# EAGLE design UserInterface_RevB (EAGLE 7.6.0)

## Sheet 1 of 2
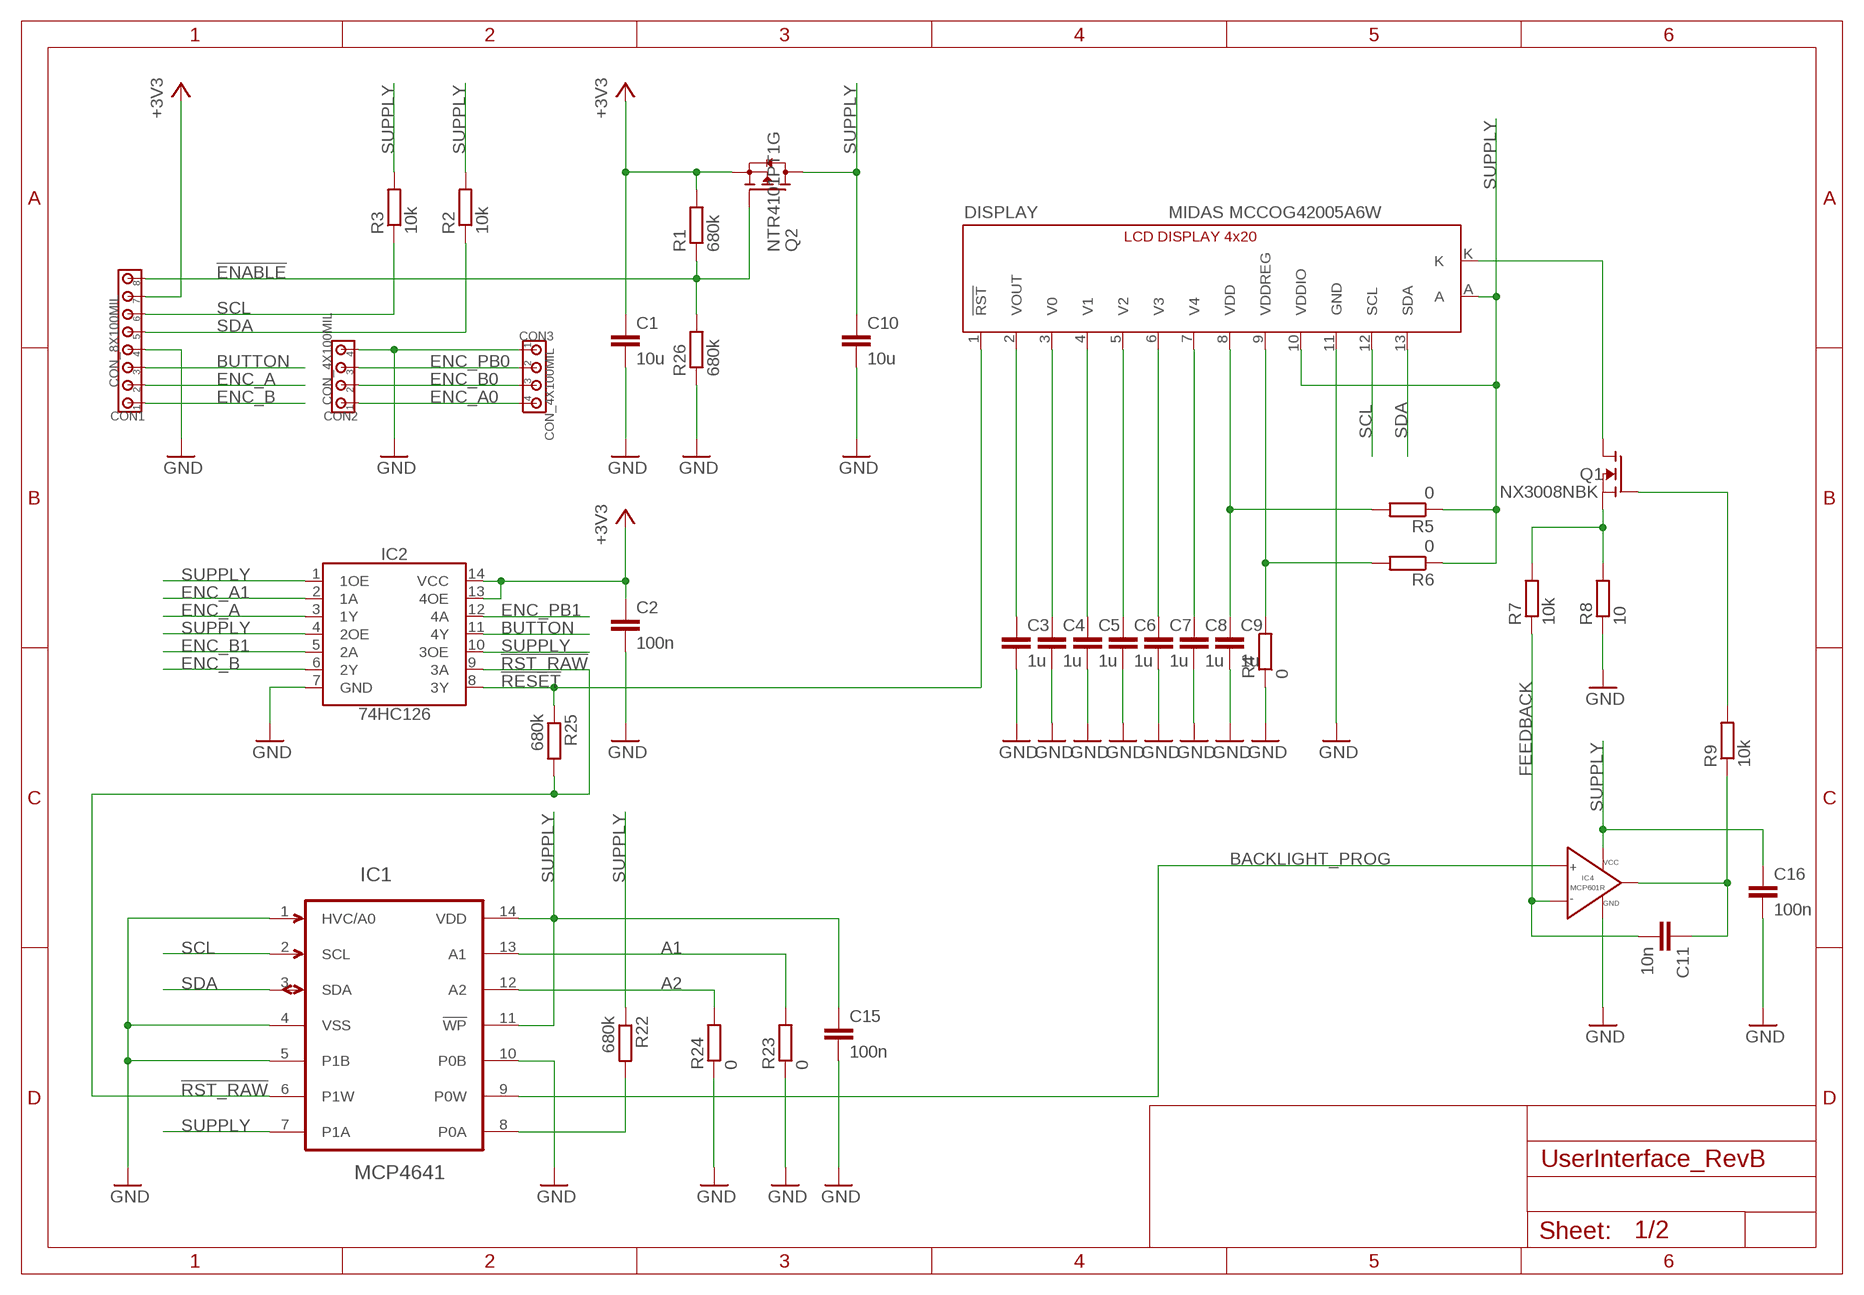
[diagram p0: schematic, sheet 1]

### Parts
C1  10u  CC0805  [C0805]
C2  100n  CC0805  [C0805]
C3  1u  CC0805  [C0805]
C4  1u  CC0805  [C0805]
C5  1u  CC0805  [C0805]
C6  1u  CC0805  [C0805]
C7  1u  CC0805  [C0805]
C8  1u  CC0805  [C0805]
C9  1u  CC0805  [C0805]
C10  10u  CC0805  [C0805]
C11  10n  CC0805  [C0805]
C15  100n  CC0805  [C0805]
C16  100n  CC0805  [C0805]
CON1  CON_8X100MIL  [100MIL_8X]
CON2  CON_4X100MIL  [100MIL_4X]
CON3  CON_4X100MIL  [100MIL_4X]
DISPLAY  MIDAS MCCOG42005A6W  LCD4X20_I2C  [LCD_4X20_I2C]
IC1  MCP4641  [TSSOP14]
IC2  74HC126  [SO14]
IC4  MCP601R  [SOT-23-5]
Q1  NX3008NBK  N-FETSOT23  [SOT23]
Q2  NTR4101PT1G  P-FETSOT23  [SOT23]
R1  680k  RESISTORR0805  [R0805]
R2  10k  RESISTORR0805  [R0805]
R3  10k  RESISTORR0805  [R0805]
R4  0  RESISTORR0805  [R0805]
R5  0  RESISTORR0805  [R0805]
R6  0  RESISTORR0805  [R0805]
R7  10k  RESISTORR0805  [R0805]
R8  10  RESISTORR0805  [R0805]
R9  10k  RESISTORR0805  [R0805]
R22  680k  RESISTORR0805  [R0805]
R23  0  RESISTORR0805  [R0805]
R24  0  RESISTORR0805  [R0805]
R25  680k  RESISTORR0805  [R0805]
R26  680k  RESISTORR0805  [R0805]

### Nets
!ENABLE!: CON1.8 Q2.1(G) R1.1 R26.2
!RESET!: DISPLAY.1(!RST!) IC2.8(3Y) R25.1
!RST_RAW!: IC1.6(P1W) IC2.9(3A) R25.2
+3V3: C1.1 C2.1 CON1.7 IC2.13(4OE) IC2.14(VCC) Q2.2(S) R1.2 ; also sheet 2
A1: IC1.13(A1) R23.2
A2: IC1.12(A2) R24.2
BACKLIGHT_PROG: IC1.9(P0W) IC4.3(VIN+)
BUTTON: CON1.3 IC2.11(4Y) ; also sheet 2
ENC_A: CON1.2 IC2.3(1Y) ; also sheet 2
ENC_A0: CON2.1 CON3.4 ; also sheet 2
ENC_A1: IC2.2(1A) ; also sheet 2
ENC_B: CON1.1 IC2.6(2Y) ; also sheet 2
ENC_B0: CON2.2 CON3.3 ; also sheet 2
ENC_B1: IC2.5(2A) ; also sheet 2
ENC_PB0: CON2.3 CON3.2 ; also sheet 2
ENC_PB1: IC2.12(4A) ; also sheet 2
FEEDBACK: C11.2 IC4.4(VIN-) R7.1
GND: C1.2 C2.2 C3.2 C4.2 C5.2 C6.2 C7.2 C8.2 C9.2 C10.2 C15.2 C16.2 CON1.4 CON2.4 CON3.1 DISPLAY.11(GND) IC1.1(HVC/A0) IC1.4(VSS) IC1.5(P1B) IC1.10(P0B) IC2.7(GND) IC4.5(GND) R4.1 R8.1 R23.1 R24.1 R26.1 ; also sheet 2
LED_K: DISPLAY.K Q1.3(D)
N$3: C3.1 DISPLAY.2(VOUT)
N$4: C4.1 DISPLAY.3(V0)
N$5: C8.1 DISPLAY.7(V4)
N$6: C7.1 DISPLAY.6(V3)
N$7: C6.1 DISPLAY.5(V2)
N$8: C5.1 DISPLAY.4(V1)
N$14: C11.1 IC4.1(VOUT) R9.1
N$15: Q1.1(G) R9.2
N$17: Q1.2(S) R7.2 R8.2
N$19: IC1.8(P0A) R22.2
SCL: CON1.6 DISPLAY.12(SCL) IC1.2(SCL) R3.1
SDA: CON1.5 DISPLAY.13(SDA) IC1.3(SDA) R2.1
SUPPLY: C10.1 C15.1 C16.1 DISPLAY.10(VDDIO) DISPLAY.A IC1.7(P1A) IC1.11(!WP!) IC1.14(VDD) IC2.1(1OE) IC2.4(2OE) IC2.10(3OE) IC4.2(VCC) Q2.3(D) R2.2 R3.2 R5.1 R6.1 R22.1 ; also sheet 2
VDD: C9.1 DISPLAY.8(VDD) R5.2
VDREG: DISPLAY.9(VDDREG) R4.2 R6.2

## Sheet 2 of 2
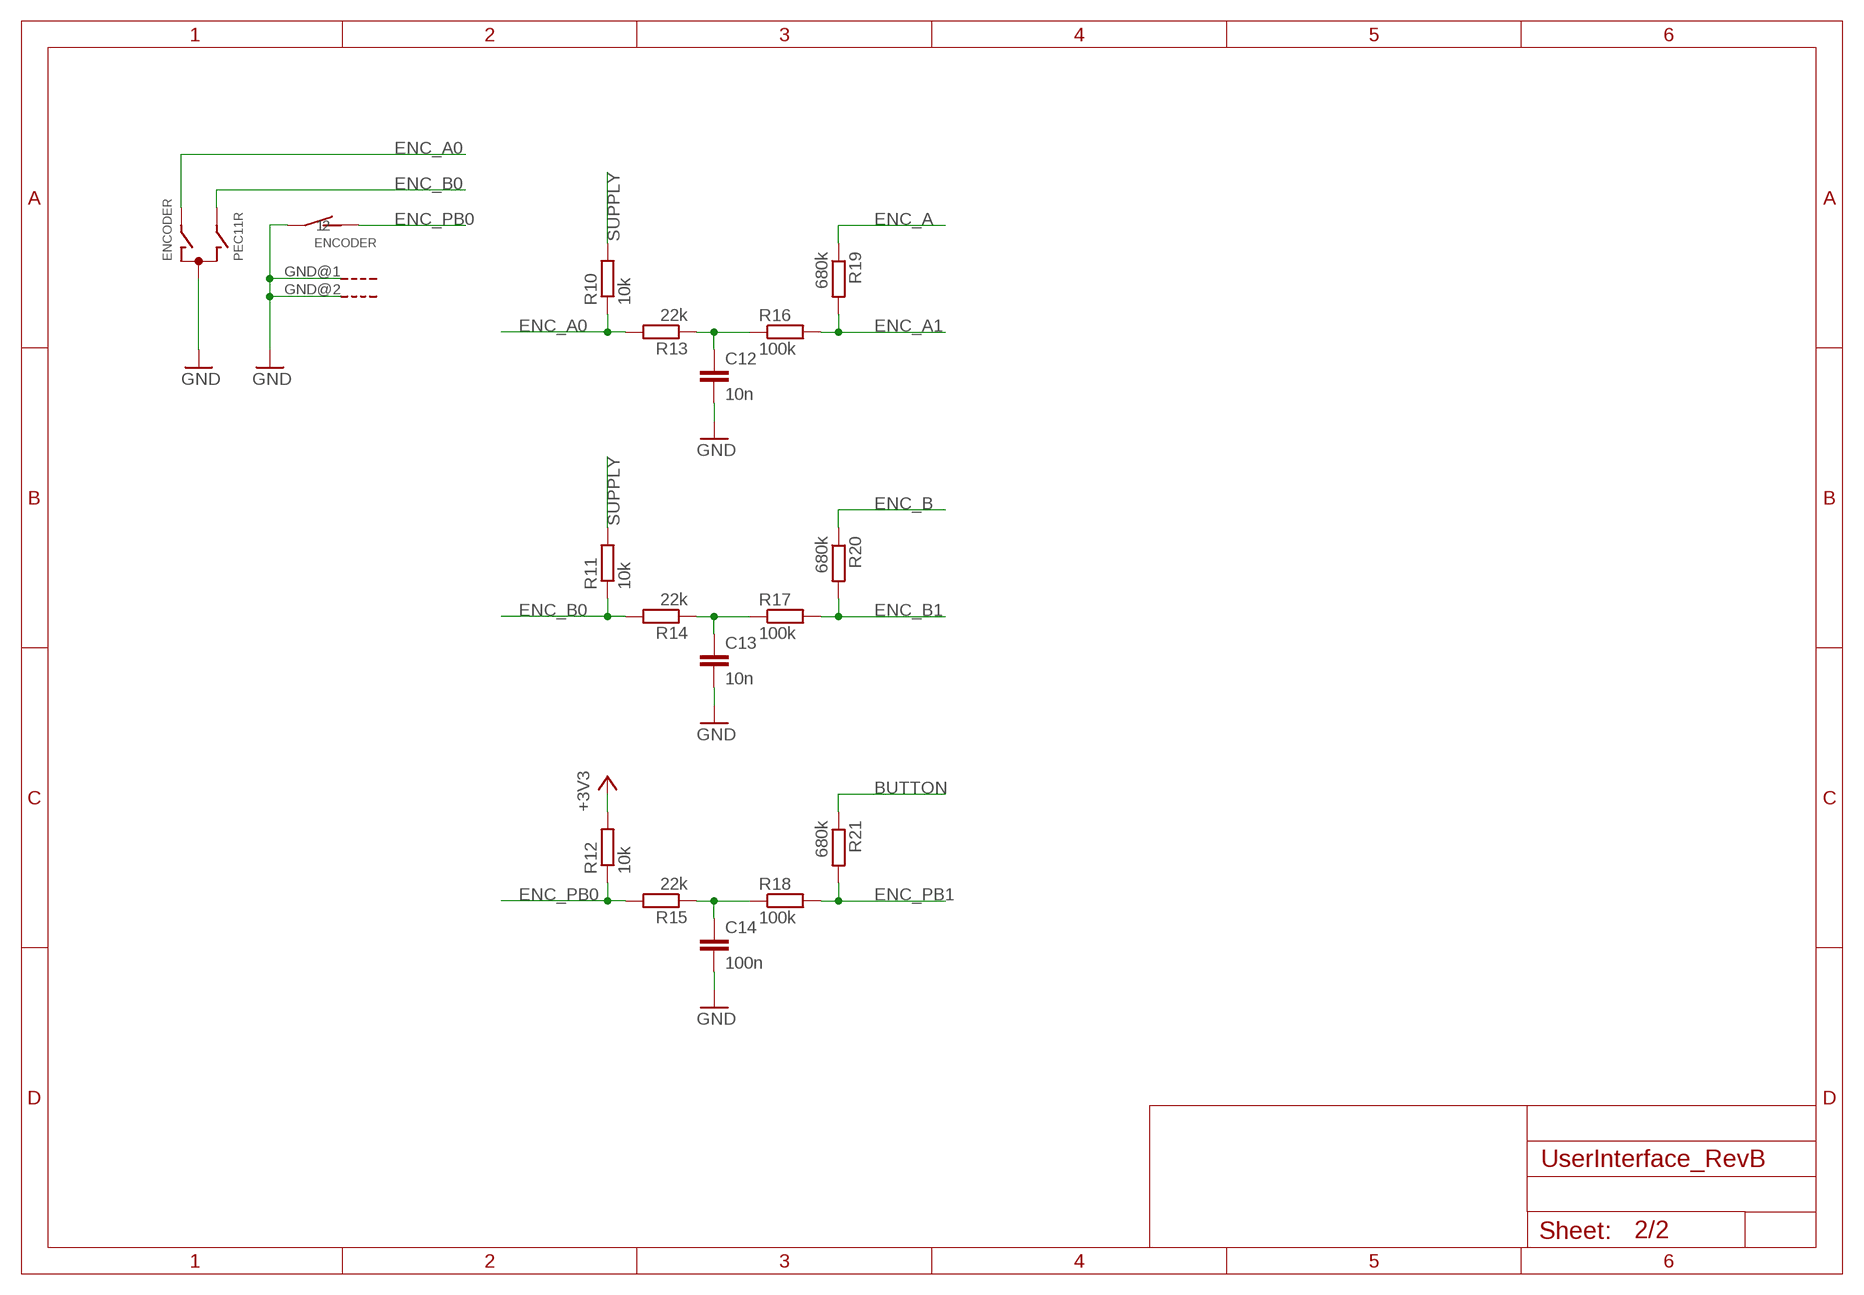
[diagram p1: schematic, sheet 2]

### Parts
C12  10n  CC0805  [C0805]
C13  10n  CC0805  [C0805]
C14  100n  CC0805  [C0805]
ENCODER  PEC11R  ENCODER_BOURNS  [ENCODER_BOURNS]
R10  10k  RESISTORR0805  [R0805]
R11  10k  RESISTORR0805  [R0805]
R12  10k  RESISTORR0805  [R0805]
R13  22k  RESISTORR0805  [R0805]
R14  22k  RESISTORR0805  [R0805]
R15  22k  RESISTORR0805  [R0805]
R16  100k  RESISTORR0805  [R0805]
R17  100k  RESISTORR0805  [R0805]
R18  100k  RESISTORR0805  [R0805]
R19  680k  RESISTORR0805  [R0805]
R20  680k  RESISTORR0805  [R0805]
R21  680k  RESISTORR0805  [R0805]

### Nets
+3V3: R12.2 ; also sheet 1
BUTTON: R21.1 ; also sheet 1
ENC_A: R19.1 ; also sheet 1
ENC_A0: ENCODER.A R10.1 R13.2 ; also sheet 1
ENC_A1: R16.2 R19.2 ; also sheet 1
ENC_B: R20.1 ; also sheet 1
ENC_B0: ENCODER.B R11.1 R14.2 ; also sheet 1
ENC_B1: R17.2 R20.2 ; also sheet 1
ENC_PB0: ENCODER.1 R12.1 R15.2 ; also sheet 1
ENC_PB1: R18.2 R21.2 ; also sheet 1
GND: C12.2 C13.2 C14.2 ENCODER.2 ENCODER.C ENCODER.GND@1(G) ENCODER.GND@2(G) ; also sheet 1
N$9: C13.1 R14.1 R17.1
N$12: C12.1 R13.1 R16.1
N$13: C14.1 R15.1 R18.1
SUPPLY: R10.2 R11.2 ; also sheet 1

## Library data of the parts
C1-C16 = 00Capacitor:C: Capacitor
CON1 = 00Connector:CON_8X: 8-pin header
CON2 CON3 = 00Connector:CON_4X: 4-pin header
DISPLAY = 00Display:LCD4X20_I2C: 4x20 character LCD display with I2C interface
ENCODER = 00Switch:ENCODER_BOURNS: Bourns Rotary Encoder with Switch PEC11-4xxxF-Sxxxx
IC1 = 00DigiPot:MCP4641: Dual DigiPot with 128 steps and non-volatile memory
IC2 = 00Logic:74HC126: Quad buffer/line driver; 3-state
IC4 = 00OpAmp:MCP601R
Q1 = 00Mosfet:N-FET: N-Channel MOSFET
Q2 = 00Mosfet:P-FET
R1-R26 = 00Resistor:RESISTOR: RESISTOR, European symbol

## Board
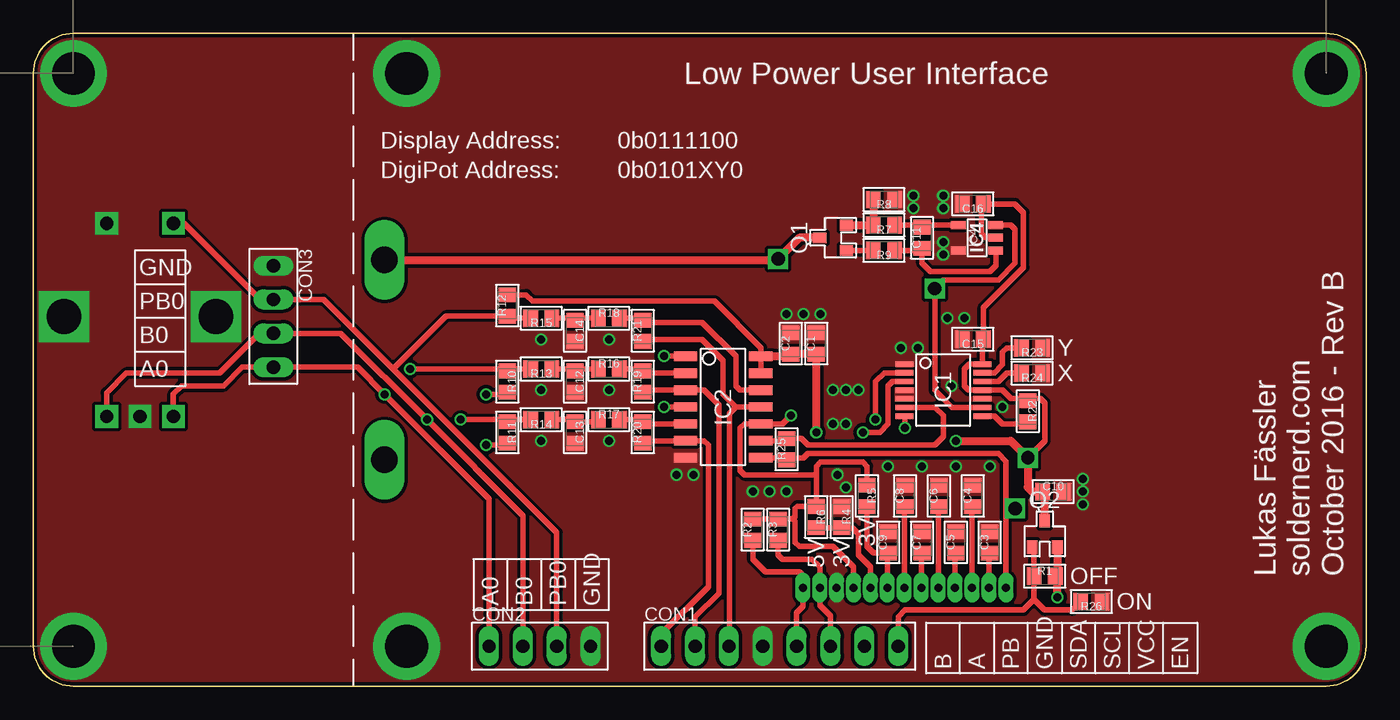
[diagram p2: board, top side]
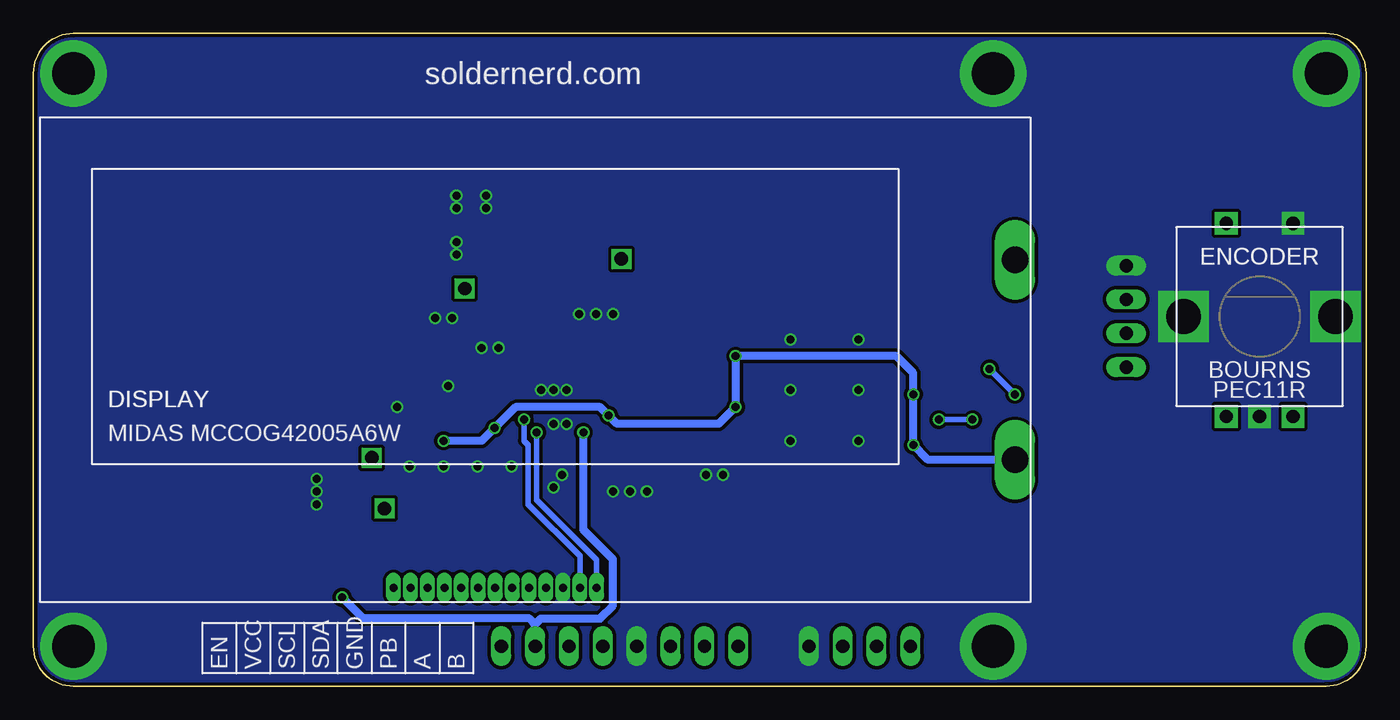
[diagram p3: board, bottom side, seen from below]

Size 100 x 49 mm. Coordinates in mm from the lower left corner, seen from the top.
Outline: 0,3 0,46 arc-90 3,49 97,49 arc-90 100,46 100,3 arc-90 97,0 3,0 arc-90 0,3
Copper layers (1*16): Top 0.035mm / dielectric 1.5mm / Bottom 0.035mm
Design rules "dirt_cheap_dirty_boards.v1": minimum track width 5mil, minimum drill 12mil, track to track 5mil, track to pad 5mil, pad to pad 5mil, via to via 5mil, smd to smd 0mil, copper to edge 10mil, drill to drill 10mil, minimum pad ring 10mil, minimum via ring 6mil, stop-mask expansion 2mil, vias tented up to drill 25mil, thermal gap 10mil

### Footprints (pad centres in the part's own frame; a part is rotated, then mirrored left to right if it is on the bottom)
C0805 = smd 1.1 x 1.3: 1 -0.8,0; 2 0.8,0
100MIL_8X = drill 1 long: 1 -8.89,0; 2 -6.35,0; 3 -3.81,0; 4 -1.27,0; 5 1.27,0; 6 3.81,0; 7 6.35,0; 8 8.89,0
100MIL_4X = drill 1 long: 1 -3.81,0; 2 -1.27,0; 3 1.27,0; 4 3.81,0
LCD_4X20_I2C = drill 0.6 pad 1 long: 1 26.53,1.1; 2 27.8,1.1; 3 29.07,1.1; 4 30.34,1.1; 5 31.61,1.1; 6 32.88,1.1; 7 34.15,1.1; 8 35.42,1.1; 9 36.69,1.1; 10 37.96,1.1; 11 39.23,1.1; 12 40.5,1.1; 13 41.77,1.1 | drill 2 long: A 73.15,10.7; K 73.15,25.7
ENCODER_BOURNS = drill 1 pad 1.7 square: 1 -2.5,7; 2 2.5,7; A -2.5,-7.5; B 2.5,-7.5; C 0,-7.5 | drill 2.6 pad 3.8 square: GND@1 -5.7,0; GND@2 5.7,0
TSSOP14 = smd 0.4 x 1.35: 1 -1.95,-2.925; 2 -1.3,-2.925; 3 -0.65,-2.925; 4 0,-2.925; 5 0.65,-2.925; 6 1.3,-2.925; 7 1.95,-2.925; 8 1.95,2.925; 9 1.3,2.925; 10 0.65,2.925; 11 0,2.925; 12 -0.65,2.925; 13 -1.3,2.925; 14 -1.95,2.925
SO14 = smd 0.7 x 1.75: 1 -3.81,-2.825; 2 -2.54,-2.825; 3 -1.27,-2.825; 4 0,-2.825; 5 1.27,-2.825; 6 2.54,-2.825; 7 3.81,-2.825; 8 3.81,2.825; 9 2.54,2.825; 10 1.27,2.825; 11 0,2.825; 12 -1.27,2.825; 13 -2.54,2.825; 14 -3.81,2.825
SOT-23-5 = smd 0.6 x 1.1: 1 -0.95,-1.4; 2 0,-1.4; 3 0.95,-1.4; 4 0.95,1.4; 5 -0.95,1.4
SOT23 = smd 0.8 x 1: 1 -0.95,-1; 2 0.95,-1; 3 0,1
R0805 = smd 1.1 x 1.3: 1 -0.8,0; 2 0.8,0

### Placement (x,y rotation side)
C1  58.74,25.72 90 top
C2  56.83,25.72 90 top
C3  71.75,10.79 90 top
C4  70.48,14.29 90 top
C5  69.22,10.79 90 top
C6  67.94,14.29 90 top
C7  66.67,10.79 90 top
C8  65.41,14.29 90 top
C9  64.14,10.79 90 top
C10  76.52,14.61 0 top
C11  66.67,33.66 90 top
C12  40.64,22.86 270 top
C13  40.64,19.05 270 top
C14  40.64,26.67 270 top
C15  70.48,26.04 180 top
C16  70.48,36.2 180 top
CON1  56,3 0 top
CON2  38,3 0 top
CON3  18,27.75 270 top
DISPLAY  99.5,6.3 0 bottom
ENCODER  8,27.75 0 bottom
IC1  68.26,22.23 270 top
IC2  51.75,20.95 270 top
IC4  70.8,33.66 90 top
Q1  60.01,33.66 90 top
Q2  75.88,11.43 0 top
R1  75.88,8.26 0 top
R2  53.98,11.75 90 top
R3  55.88,11.75 90 top
R4  60.64,12.7 270 top
R5  62.55,14.29 270 top
R6  58.74,12.7 270 top
R7  63.82,34.61 180 top
R8  63.82,36.51 180 top
R9  63.82,32.7 180 top
R10  35.56,22.86 270 top
R11  35.56,19.05 270 top
R12  35.56,28.57 90 top
R13  38.1,23.81 180 top
R14  38.1,20 180 top
R15  38.1,27.62 180 top
R16  43.18,23.81 0 top
R17  43.18,20 0 top
R18  43.18,27.62 0 top
R19  45.72,22.86 90 top
R20  45.72,19.05 90 top
R21  45.72,26.67 90 top
R22  74.61,20.64 270 top
R23  74.93,25.4 180 top
R24  74.93,23.5 180 top
R25  56.52,17.78 90 top
R26  79.38,6.35 180 top

### Tracks (layer width: path | path; a pad name or v marks a point on that pad's centre or on a via)
!ENABLE!
  Top 0.406: CON1.8 64.89,5.2 65.41,5.71 74.3,5.71 75.08,6.5 | 75.08,6.5 R1.1 75.08,10.28 Q2.1 | 75.08,6.5 75.87,5.71 77.94,5.71 R26.2
!RESET!  (via drill 1)
  Top 0.406: DISPLAY.1 72.97,13.34 | 72.97,13.34 72.97,16.88 72.39,17.46 58.1,17.46 57.78,17.14 56.52,17.14 R25.1 56.35,17.14 IC2.8 | v73.66,13.34 72.97,13.34
!RST_RAW!
  Top 0.406: IC2.9 56.35,18.41 R25.2 57.62,18.58 58.1,18.1 67.63,18.1 68.26,18.73 68.26,20.32 67.66,20.93 IC1.6
+3V3  (via drill 0.6)
  Top 0.406: R12.2 36.98,29.38 37.47,28.89 51.12,28.89 54.61,25.4 54.61,24.8 IC2.14 IC2.13 | 56.71,24.8 56.83,24.8 C2.1
  Top 0.61: v58.74,19.05 C1.1 C2.1 | 54.61,24.8 56.71,24.8 | Q2.2 76.83,8.4 R1.2 76.83,8.1 v76.83,6.67
  Bottom 0.61: CON1.7 62.35,4.64 | v58.74,19.05 58.74,11.75 56.52,9.53 56.52,6.03 57.47,5.08 61.91,5.08 62.35,4.64 | v76.83,6.67 75.25,5.08 62.79,5.08 62.35,4.64
A1
  Top 0.406: IC1.13 72.1,23.52 72.71,24.13 72.71,25.08 73.03,25.4 R23.2
A2
  Top 0.406: IC1.12 72.41,22.88 73.03,23.5 R24.2
BACKLIGHT_PROG  (via drill 1)
  Top 0.406: IC1.9 68.93,20.93 67.63,22.23 v67.63,29.84 68.26,30.48 72.39,30.48 73.66,31.75 73.66,34.29 73.34,34.61 IC4.3
BUTTON
  Top 0.406: R21.1 45.88,26.04 50.16,26.04 51.75,24.45 51.75,21.91 52.7,20.95 | 52.7,20.95 52.23,20.48 52.23,3.04 CON1.3 | 52.7,20.95 IC2.11
ENC_A
  Top 0.406: R19.1 45.88,22.23 IC2.3 50.32,22.23 51.44,21.11 51.44,6.99 49.65,5.2 CON1.2
ENC_A0  (via drill 0.6)
  Top 0.406: ENCODER.A 10.5,21.93 11.11,22.54 14.29,22.54 15.69,23.94 CON3.4 24.32,23.94 v26.35,21.91 34.19,14.07 CON2.1 | v28.26,23.81 35.41,23.81 R10.1 35.71,23.81 R13.2
  Bottom 0.406: v28.26,23.81 v26.35,21.91
ENC_A1
  Top 0.406: R16.2 45.57,23.81 R19.2 45.88,23.5 IC2.2
ENC_B
  Top 0.406: R20.1 45.88,18.41 IC2.6 50.32,18.41 50.64,18.1 50.64,7.46 47.11,3.93 CON1.1
ENC_B0  (via drill 0.6)
  Top 0.406: ENCODER.B 5.5,22.01 6.99,23.5 13.97,23.5 16.95,26.48 CON3.3 23.05,26.48 v29.53,20 36.73,12.8 CON2.2 | v32.07,20 35.41,20 R11.1 35.71,20 R14.2
  Bottom 0.406: v32.07,20 v29.53,20
ENC_B1
  Top 0.406: R17.2 45.57,20 R20.2 45.88,19.68 IC2.5
ENC_PB0
  Top 0.406: 26.99,23.81 21.78,29.02 CON3.2 17.02,29.02 11.29,34.75 ENCODER.1 | 26.99,23.81 39.27,11.53 CON2.3 | R15.2 35.71,27.62 R12.1 30.95,27.77 26.99,23.81
ENC_PB1
  Top 0.406: IC2.12 53.02,22.23 52.7,22.54 52.7,24.77 50.16,27.3 45.88,27.3 R21.2 45.57,27.62 R18.2
FEEDBACK
  Top 0.406: R7.1 66.52,34.61 C11.2 66.83,34.6 IC4.4
GND  (via drill 0.6, 3.2 pad 5)
  other vias: 3,46 28,46 28,3 3,3 97,3 97,46 38.1,26.04 43.18,26.04 43.18,22.23 38.1,22.23 38.1,18.41 43.18,18.41 60.33,15.88 60.96,14.92 66.04,36.83 68.58,27.62 66.04,35.88 69.85,27.62 65.09,25.4 66.36,25.4 68.9,22.54 72.71,20.95 49.53,15.88 48.26,15.88 64.14,16.51 66.67,16.51 69.22,16.51 56.52,27.94 57.78,27.94 59.05,27.94 78.74,14.61 78.74,13.65 60.01,22.23 60.96,22.23 60.01,19.68 60.96,19.68 71.75,16.51 53.98,14.61 55.24,14.61 56.52,14.61 78.74,15.56 68.26,32.38 68.26,35.88 68.26,36.83 68.26,33.34 61.91,22.23
  pour Bottom (isolate 0.25, no thermals): 3,49 97,49 arc-90 100,46 100,3 arc-90 97,0 3,0 arc-90 0,3 0,46 arc-90
  pour Top (isolate 0.25, no thermals): 3,49 97,49 arc-90 100,46 100,3 arc-90 97,0 3,0 arc-90 0,3 0,46 arc-90
LED_K  (via drill 1)
  Top 0.61: Q1.3 57.47,33.66 v55.88,32.07 55.81,32 DISPLAY.K
N$3
  Top 0.406: DISPLAY.2 71.7,9.94 C3.1
N$4
  Top 0.406: DISPLAY.3 70.43,13.43 C4.1
N$5
  Top 0.406: DISPLAY.7 65.35,13.43 C8.1
N$6
  Top 0.406: DISPLAY.6 66.62,9.94 C7.1
N$7
  Top 0.406: DISPLAY.5 67.89,13.43 C6.1
N$8
  Top 0.406: DISPLAY.4 69.16,9.94 C5.1
N$9
  Top 0.406: R14.1 40.49,20 C13.1 42.23,19.85 R17.1
N$12
  Top 0.406: R16.1 40.79,23.81 C12.1 40.49,23.81 R13.1
N$13
  Top 0.406: R15.1 40.49,27.62 C14.1 40.79,27.62 R18.1
N$14
  Top 0.406: R9.1 66.52,32.7 C11.1 66.67,31.75 67.31,31.11 71.75,31.11 72.2,31.56 IC4.1
N$15
  Top 0.406: Q1.1 R9.2
N$17
  Top 0.406: R7.2
  Top 0.61: R8.2 R7.2 | Q1.2 R7.2
N$19
  Top 0.406: IC1.8 72.12,20.27 72.71,19.68 74.46,19.68 R22.2
SCL  (via drill 0.6)
  Top 0.406: R3.1 55.88,9.84 56.2,9.53 58.42,9.53 59,8.95 DISPLAY.12 59,6.09 59.81,5.28 CON1.6 | IC1.2 63.85,23.52 63.18,22.86 v63.18,20
  Bottom 0.406: v63.18,20 63.18,18.41 62.87,18.1 62.87,13.65 59,9.79 DISPLAY.12
SDA  (via drill 0.6)
  Top 0.406: R2.1 53.98,9.53 54.93,8.57 57.47,8.57 57.73,8.31 DISPLAY.13 57.73,5.98 57.27,5.52 CON1.5 | IC1.3 64.47,22.88 64.14,22.54 64.14,19.68 63.5,19.05 v62.23,19.05
  Bottom 0.406: v62.23,19.05 62.23,13.97 57.73,9.47 DISPLAY.13
SUPPLY  (via drill 0.6, 1)
  Top 0.305: IC1.7 65.41,20.21
  Top 0.406: IC2.1 v47.31,24.77 | IC2.4 v47.31,20.95 | v33.98,21.91 v33.97,21.91 35.41,21.91 R10.2 | v33.97,18.1 v33.98,18.1 35.41,18.1 R11.2 | DISPLAY.10 61.54,8.95 60.01,10.48 57.47,10.48 57.15,10.79 57.15,12.38 56.98,12.55 | R2.2 R3.2 56.98,12.55 | 56.98,12.55 57.15,12.71 57.15,13.34 57.31,13.5 R6.1 58.74,15.88 | 75.88,14.61 C10.1 | v56.83,20.32 56.2,19.68 IC2.10 53.34,19.68 53.02,19.37 53.02,16.19 53.34,15.88 58.74,15.88 | R5.1 62.55,16.51 62.23,16.83 59.05,16.83 58.74,16.51 58.74,15.88 | v74.61,17.14 75.88,18.41 75.88,21.27 75.56,21.59 74.61,21.59 R22.1 74.46,21.59 73.34,21.59 72.71,22.23 IC1.11 70.17,22.23 69.85,22.54 69.85,23.81 70.21,24.18 IC1.14 71.19,26.04 C15.1 71.28,28.42 74.3,31.43 74.3,35.56 73.66,36.2 C16.1 71.12,36.03 71.12,33.97 71.44,33.66 IC4.2 | v65.41,19.37 65.41,20.21
  Top 0.61: v69.22,18.41 73.34,18.41 v74.61,17.14 74.61,14.92 74.93,14.61 C10.1 75.88,14.44 Q2.3
  Bottom 0.61: DISPLAY.A 32.88,17 v33.97,18.1 v33.97,21.91 33.97,23.5 35.24,24.77 v47.31,24.77 v47.31,20.95 48.58,19.68 56.2,19.68 v56.83,20.32 57.47,20.95 63.82,20.95 v65.41,19.37 66.36,18.41 v69.22,18.41
VDD
  Top 0.406: DISPLAY.8 64.08,9.94 C9.1 63.03,9.99 62.55,10.48 R5.2
VDREG
  Top 0.406: DISPLAY.9 62.81,8.95 61.91,9.84 61.91,11.43 61.44,11.9 R4.2 R6.2

### Text on the board
tPlace: Low Power User Interface | Display Address: | 0b0111100 | DigiPot Address: | 0b0101XY0 | GND | PB0 | B0 | Y | A0 | X | 3V | 5V | 3V | OFF | Lukas Fässler | soldernerd.com | October 2016 - Rev B | A0 | B0 | PB0 | GND | ON | B | A | PB | GND | SDA | SCL | VCC | EN
bPlace: soldernerd.com | B | A | PB | GND | SDA | SCL | VCC | EN